# Altium project ESPCM4FPU_V1.PrjPcb
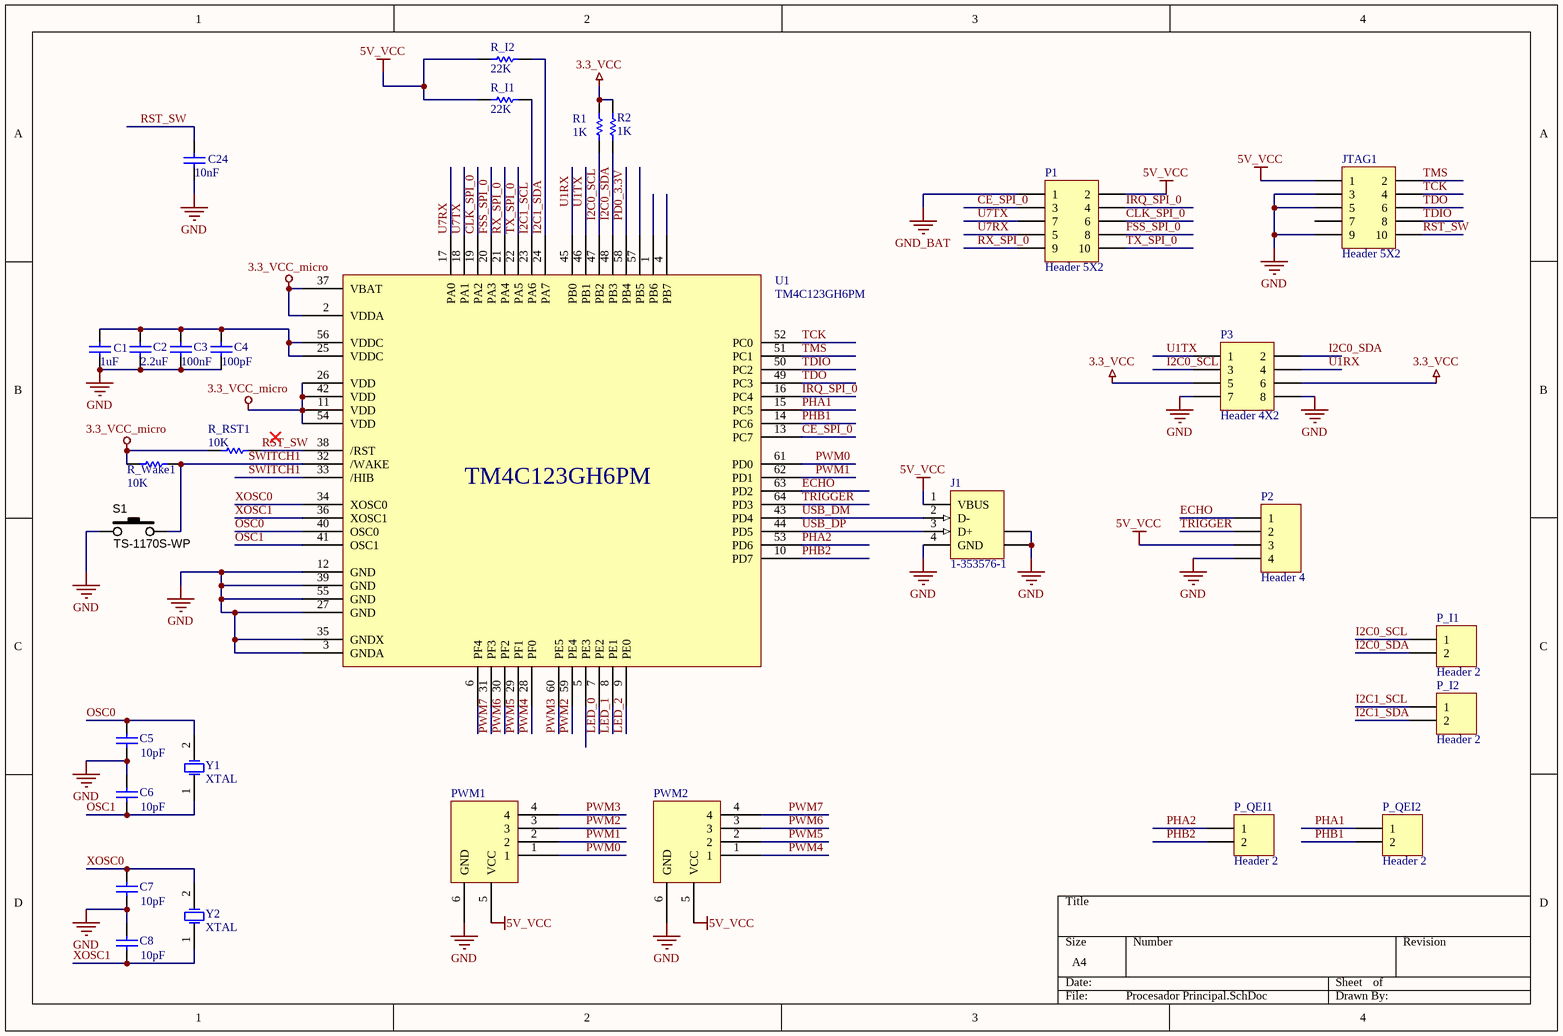
[diagram p0: Procesador Principal.SchDoc]
4 sheets, 76 parts. Net scope: global (net labels, ports and power ports of the same name join across sheets).
Board file: PCB_I.PcbDoc
Sheets:
  Procesador Principal.SchDoc
  Procesador Auxiliar.SchDoc
  Sensores.SchDoc
  Alimentacion.SchDoc

## Sheet Procesador Principal.SchDoc
size A4

### Parts
C1  value 1uF  [6-0805_L]  (hidden comment: Cap)
C2  value 2.2uF  [6-0805_L]  (hidden comment: Cap)
C3  value 100nF  [6-0805_L]  (hidden comment: Cap)
C4  value 100pF  [6-0805_L]  (hidden comment: Cap)
C5  value 10pF  [C0805]  (hidden comment: Cap)
C6  value 10pF  [C0805]  (hidden comment: Cap)
C7  value 10pF  [C0805]  (hidden comment: Cap)
C8  value 10pF  [C0805]  (hidden comment: Cap)
C24  value 10nF  [6-0805_L]  (hidden comment: Cap)
J1  1-353576-1  [Micro USB]
JTAG1  Header 5X2  [HDR2X5]
P1  Header 5X2  [SMD_HEADER 5x2]
P2  Header 4  [HDR1X4]
P3  Header 4X2  [SMD_HEADER 4x2]
P_I1  Header 2  [HDR1X2]
P_I2  Header 2  [HDR1X2]
P_QEI1  Header 2  [HDR1X2]
P_QEI2  Header 2  [HDR1X2]
PWM1  Header 4 x 3  [Header_4x3_mirror]  (value not drawn)
PWM2  Header 4 x 3  [Header_4x3]  (value not drawn)
R1  value 1K  [C0805]  (hidden comment: Res1)
R2  value 1K  [6-0805_L]  (hidden comment: Res1)
R_I1  value 22K  [C1206]  (hidden comment: Res1)
R_I2  value 22K  [C1206]  (hidden comment: Res1)
R_RST1  value 10K  [C1206]  (hidden comment: Res1)
R_Wake1  value 10K  [C0805]  (hidden comment: Res1)
S1  TS-1170S-WP  [TS-1170S]
U1  TM4C123GH6PM  [SQFP50P1200X1200-64L]
Y1  XTAL  [CFPX-5]
Y2  XTAL  [BCY-W2/D2.1]

### Nets
3.3_VCC: P3.5 P3.6 R1.1 R2.2
3.3_VCC_micro: R_RST1.1 R_Wake1.1 U1.2(VDDA) U1.11(VDD) U1.26(VDD) U1.37(VBAT) U1.42(VDD) U1.54(VDD)
5V_VCC: J1.1(VBUS) JTAG1.1 P1.2 P2.3 PWM1.5(VCC) PWM2.5(VCC) R_I1.2 R_I2.2
GND: C1.1 C2.1 C3.1 C4.1 C5.1 C6.2 C7.1 C8.2 C24.1 J1.4(GND) J1.5(SHLD) J1.6(SHLD) JTAG1.3 JTAG1.5 JTAG1.9 P2.4 P3.7 P3.8 PWM1.6(GND) PWM2.6(GND) S1.1 U1.3(GNDA) U1.12(GND) U1.27(GND) U1.35(GNDX) U1.39(GND) U1.55(GND)
GND_BAT: P1.1
CE_SPI_0: P1.3 U1.13(PC7)
CLK_SPI_0: P1.6 U1.19(PA2)
ECHO: P2.1 U1.63(PD2)
FSS_SPI_0: P1.8 U1.20(PA3)
I2C0_SCL: P3.3 P_I1.1 R1.2 U1.47(PB2)
I2C0_SDA: P3.2 P_I1.2 R2.1 U1.48(PB3)
I2C1_SCL: P_I2.1 R_I1.1 U1.23(PA6)
I2C1_SDA: P_I2.2 R_I2.1 U1.24(PA7)
IRQ_SPI_0: P1.4 U1.16(PC4)
LED_0: U1.7(PE2)
LED_1: U1.8(PE1)
LED_2: U1.9(PE0)
OSC0: C5.2 U1.40(OSC0) Y1.2(OSC2)
OSC1: C6.1 U1.41(OSC1) Y1.1(OSC1)
PD0_3.3V: U1.58(PB4)
PHA1: P_QEI2.1 U1.15(PC5)
PHA2: P_QEI1.1 U1.53(PD6)
PHB1: P_QEI2.2 U1.14(PC6)
PHB2: P_QEI1.2 U1.10(PD7)
PWM0: PWM1.1 U1.61(PD0)
PWM1: PWM1.2 U1.62(PD1)
PWM2: PWM1.3 U1.59(PE4)
PWM3: PWM1.4 U1.60(PE5)
PWM4: PWM2.1 U1.28(PF0)
PWM5: PWM2.2 U1.29(PF1)
PWM6: PWM2.3 U1.30(PF2)
PWM7: PWM2.4 U1.31(PF3)
RST_SW: C24.2 JTAG1.10 R_RST1.2 U1.38(/RST)
RX_SPI_0: P1.9 U1.21(PA4)
SWITCH1: R_Wake1.2 S1.2 U1.32(/WAKE) U1.33(/HIB)
TCK: JTAG1.4 U1.52(PC0)
TDIO: JTAG1.8 U1.50(PC2)
TDO: JTAG1.6 U1.49(PC3)
TMS: JTAG1.2 U1.51(PC1)
TRIGGER: P2.2 U1.64(PD3)
TX_SPI_0: P1.10 U1.22(PA5)
U1RX: P3.4 U1.45(PB0)
U1TX: P3.1 U1.46(PB1)
U7RX: P1.5 U1.17(PA0)
U7TX: P1.7 U1.18(PA1)
USB_DM: J1.2(D-) U1.43(PD4)
USB_DP: J1.3(D+) U1.44(PD5)
XOSC0: C7.2 U1.34(XOSC0) Y2.2(OSC2)
XOSC1: C8.1 U1.36(XOSC1) Y2.1(OSC1)
NetC1_2: C1.2 C2.2 C3.2 C4.2 U1.25(VDDC) U1.56(VDDC)

Not connected (* = marked no-connect by the designer): JTAG1 7; U1 1(PB6) 4(PB7) 5(PE3) 6(PF4) 57(PB5)

### Library data of the parts
C1-C8 C24 = Cap: Capacitor; Published: 8-Jun-2000; LatestRevisionDate: 17-Jul-2002; LatestRevisionNote: Re-released for DXP Platform.; PackageReference: RAD-0.3; Publisher: Altium Limited; PackageDescription: Radial Cap, Thru-Hole; 2 Leads; 0.3 in Pin Spacing
J1 = 1-353576-1: USB 1.1, Right Angle, SMT, A Type, Receptacle, 4 Position, White; ContactMaterial: Copper Alloy; ContactPlating: Gold over Palladium Nickel; PCB_Layout: Complies with manufacturer's recommendation.; DrillSize: Corresponds to nominal value.; PanelGround: Without; Published: 15-Jul-2004; DatasheetDocument: 11-Apr-2003; PackageDocument: 11-Apr-2003; PackageReference: 353576; Publisher: Altium Limited; HousingMaterial: Thermoplastic; ComponentLink1Description: Manufacturer Link; ComponentLink1URL: http://www.tycoelectronics.com/; ComponentLink2Description: Packaging Specification; ComponentLink2URL: http://ecommas.tycoelectronics.com/commerce/DocumentDelivery/DDEController?Action=showdoc&DocId=Customer+Drawing%7F353576%7FD%7Ftif%7FJapanese%7FJPN_CD_353576_D.tif
JTAG1 P1 = Header 5X2: Header, 5-Pin, Dual row; LatestRevisionDate: 17-Jul-2002; LatestRevisionNote: Re-released for DXP Platform.; Publisher: Altium Limited
P2 = Header 4: Header, 4-Pin; LatestRevisionDate: 17-Jul-2002; LatestRevisionNote: Re-released for DXP Platform.; Publisher: Altium Limited
P3 = Header 4X2: Header, 4-Pin, Dual row; LatestRevisionDate: 17-Jul-2002; LatestRevisionNote: Re-released for DXP Platform.; Publisher: Altium Limited
P_I1 P_I2 P_QEI1 P_QEI2 = Header 2: Header, 2-Pin; LatestRevisionDate: 17-Jul-2002; LatestRevisionNote: Re-released for DXP Platform.; Publisher: Altium Limited
R1 R2 R_I1 R_I2 R_RST1 R_Wake1 = Res1: Resistor; Published: 8-Jun-2000; LatestRevisionDate: 17-Jul-2002; LatestRevisionNote: Re-released for DXP Platform.; PackageReference: AXIAL-0.3; Publisher: Altium Limited; PackageDescription: Axial Device, Thru-Hole; 2 Leads; 0.3 in Pin Spacing
S1 = SW_SMD_PB_7.0mm: Switch SMD Tact 7.0mm Stem; Manufacturer 1: Bond-Tact; Manufacturer Part Number 1: TS-1170S-WP-200; SCDType: source; Function: On/Off; Package / Case: 6.5x6.5mm; 7.0mm stem; ComponentLink1URL: http://www.bondtact.com.hk/zaspx/productd.aspx?catno=3&subcatid=3&PageNo=2&productno=40; ComponentLink1Description: http://www.bondtact.com.hk/zaspx/productd.aspx?catno=3&subcatid=3&PageNo=2&productno=40
Y1 Y2 = XTAL: Crystal Oscillator; Published: 8-Jun-2000; LatestRevisionDate: 17-Jul-2002; LatestRevisionNote: Re-released for DXP Platform.; PackageReference: R38; Publisher: Altium Limited; PackageDescription: Crystal, Thru-Hole; 2 Leads; Body 3.1 x 8.2 mm (Dia.xH)

## Sheet Procesador Auxiliar.SchDoc
size A4
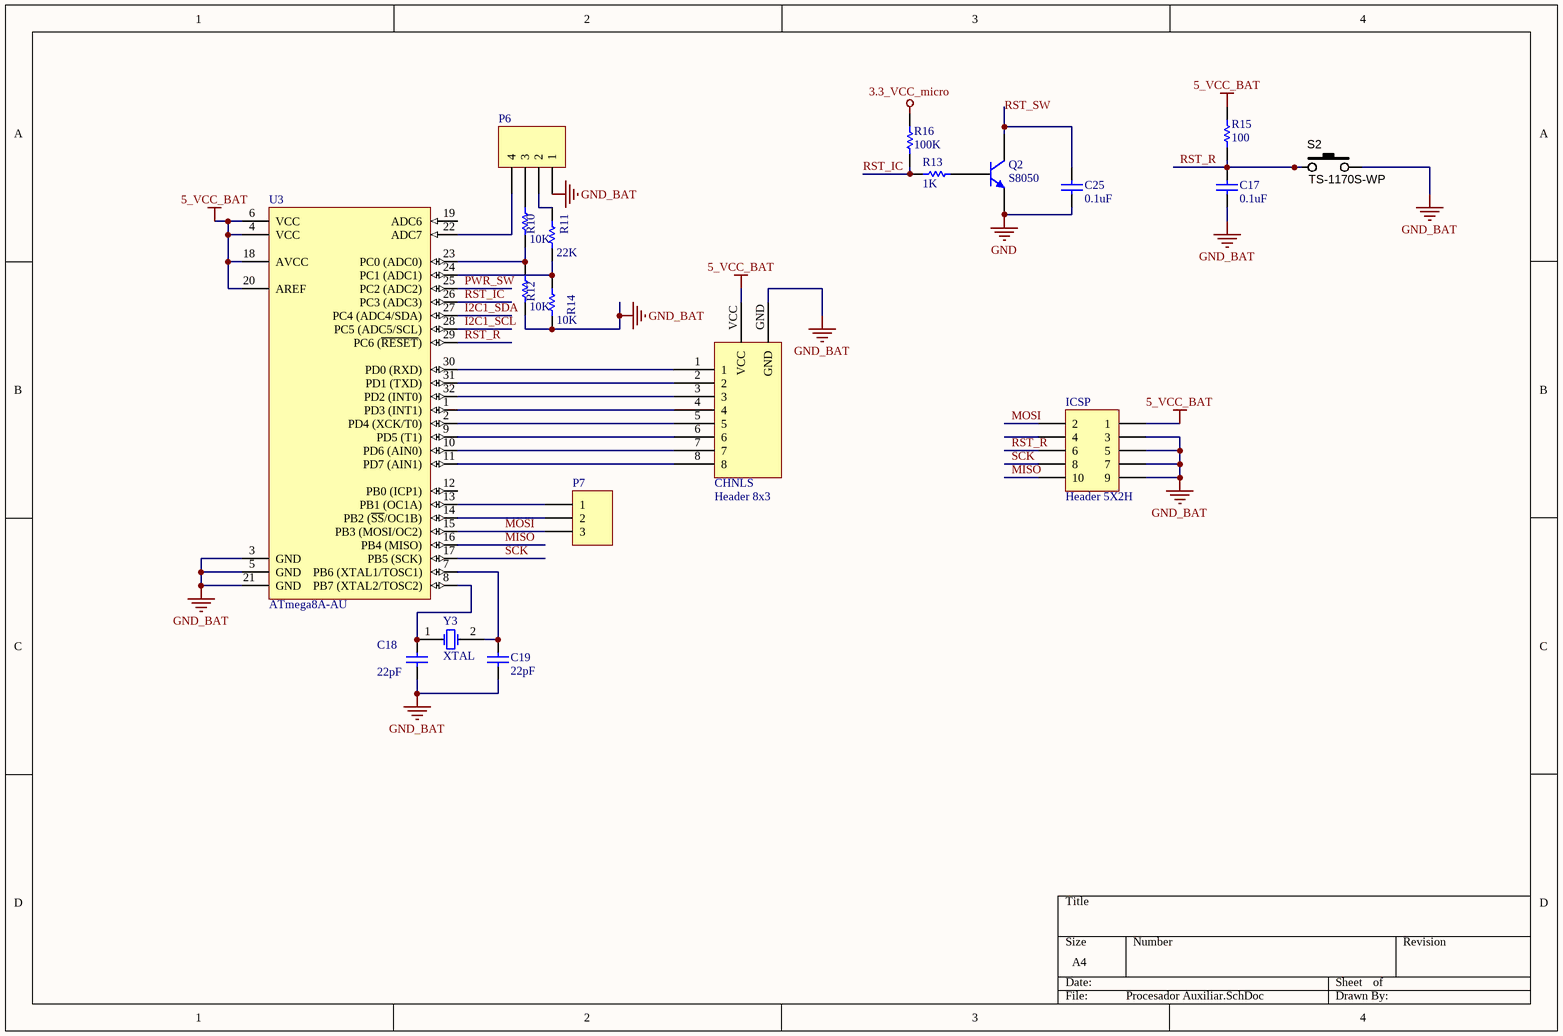
[diagram p1: Procesador Auxiliar.SchDoc]

### Parts
C17  value 0.1uF  [C0805]  (hidden comment: Cap)
C18  value 22pF  [6-0805_L]  (hidden comment: Cap Pol1)
C19  value 22pF  [6-0805_L]  (hidden comment: Cap Pol1)
C25  value 0.1uF  [C0805]  (hidden comment: Cap)
CHNLS  Header 8x3  [Header 8x3_mirror]
ICSP  Header 5X2H  [HDR2X5]
P6  Header 4  [HDR1X4]  (value not drawn)
P7  Header 3  [HDR1X3]  (value not drawn)
Q2  S8050  [SOT23-3]
R10  value 10K  [C0805]  (hidden comment: Res1)
R11  value 22K  [C0805]  (hidden comment: Res1)
R12  value 10K  [C1206]  (hidden comment: Res1)
R13  value 1K  [C0805]  (hidden comment: Res1)
R14  value 10K  [C0805]  (hidden comment: Res1)
R15  value 100  [C0805]  (hidden comment: Res1)
R16  value 100K  [C0805]  (hidden comment: Res1)
S2  TS-1170S-WP  [TS-1170S]
U3  ATmega8A-AU  [32A_N]
Y3  XTAL  [4SMX]

### Nets
3.3_VCC_micro: R16.1
5_VCC_BAT: CHNLS.VCC ICSP.1 R15.1 U3.4(VCC) U3.6(VCC) U3.18(AVCC) U3.20(AREF)
GND: C25.1 Q2.2(E)
GND_BAT: C17.1 C18.1 C19.1 CHNLS.GND ICSP.3 ICSP.5 ICSP.7 ICSP.9 P6.1 R12.1 R14.1 S2.2 U3.3(GND) U3.5(GND) U3.21(GND)
I2C1_SCL: U3.28(PC5_(ADC5/SCL))
I2C1_SDA: U3.27(PC4_(ADC4/SDA))
MISO: ICSP.10 U3.16(PB4_(MISO))
MOSI: ICSP.2 P7.3 U3.15(PB3_(MOSI/OC2))
PWR_SW: U3.25(PC2_(ADC2))
RST_IC: R13.2 R16.2 U3.26(PC3_(ADC3))
RST_R: C17.2 ICSP.6 R15.2 S2.1 U3.29(PC6_(~{RESET}))
RST_SW: C25.2 Q2.3(C)
SCK: ICSP.8 U3.17(PB5_(SCK))
NetC18_2: C18.2 U3.8(PB7_(XTAL2/TOSC2)) Y3.1(OSC1)
NetC19_2: C19.2 U3.7(PB6_(XTAL1/TOSC1)) Y3.2(OSC2)
NetCHNLS_1: CHNLS.1 U3.30(PD0_(RXD))
NetCHNLS_2: CHNLS.2 U3.31(PD1_(TXD))
NetCHNLS_3: CHNLS.3 U3.32(PD2_(INT0))
NetCHNLS_4: CHNLS.4 U3.1(PD3_(INT1))
NetCHNLS_5: CHNLS.5 U3.2(PD4_(XCK/T0))
NetCHNLS_6: CHNLS.6 U3.9(PD5_(T1))
NetCHNLS_7: CHNLS.7 U3.10(PD6_(AIN0))
NetCHNLS_8: CHNLS.8 U3.11(PD7_(AIN1))
NetP6_2: P6.2 R11.2
NetP6_3: P6.3 R10.2
NetP6_4: P6.4 U3.22(ADC7)
NetP7_1: P7.1 U3.13(PB1_(OC1A))
NetP7_2: P7.2 U3.14(PB2_(~{SS}/OC1B))
NetQ2_1: Q2.1(B) R13.1
NetR10_1: R10.1 R12.2 U3.23(PC0_(ADC0))
NetR11_1: R11.1 R14.2 U3.24(PC1_(ADC1))

Not connected (* = marked no-connect by the designer): ICSP 4; U3 12(PB0_(ICP1)) 19(ADC6)

### Library data of the parts
C17-C19 C25 = Cap: Capacitor; Published: 8-Jun-2000; LatestRevisionDate: 17-Jul-2002; LatestRevisionNote: Re-released for DXP Platform.; PackageReference: RAD-0.3; Publisher: Altium Limited; PackageDescription: Radial Cap, Thru-Hole; 2 Leads; 0.3 in Pin Spacing
ICSP = Header 5X2H: Header, 5-Pin, Dual row, Right Angle; LatestRevisionDate: 17-Jul-2002; LatestRevisionNote: Re-released for DXP Platform.; Publisher: Altium Limited
P6 = Header 4: Header, 4-Pin; LatestRevisionDate: 17-Jul-2002; LatestRevisionNote: Re-released for DXP Platform.; Publisher: Altium Limited
P7 = Header 3: Header, 3-Pin; LatestRevisionDate: 17-Jul-2002; LatestRevisionNote: Re-released for DXP Platform.; Publisher: Altium Limited
Q2 = S8050: NPN SMD General Purpose Amplifier; Published: 8-Jun-2000; LatestRevisionDate: 15-Jan-2003; LatestRevisionNote: PCB Footprint 'BCY-W3/D4.7' replaced; DatasheetVersion: 1997; PackageVersion: Sep-1998; PackageReference: TO-92A; Publisher: Altium Limited; PackageDescription: TO, Flat Index; 3 In-Line, Axial Leads; Body Dia. 4.5mm; Leads 0.51 x 0.48 mm (max); ComponentLink1Description: Manufacturer Link; ComponentLink1URL: http://www.fairchildsemi.com/; ComponentLink2Description: Datasheet; ComponentLink2URL: http://www.fairchildsemi.com/ds/2N%2F2N3904.pdf
R10-R16 = Res1: Resistor; Published: 8-Jun-2000; LatestRevisionDate: 17-Jul-2002; LatestRevisionNote: Re-released for DXP Platform.; PackageReference: AXIAL-0.3; Publisher: Altium Limited; PackageDescription: Axial Device, Thru-Hole; 2 Leads; 0.3 in Pin Spacing
S2 = SW_SMD_PB_7.0mm: as S1 on sheet Procesador Principal; Package / Case: 6.5x6.5mm; 7.0mm stem; ComponentLink1URL: http://www.bondtact.com.hk/zaspx/productd.aspx?catno=3&subcatid=3&PageNo=2&productno=40; ComponentLink1Description: http://www.bondtact.com.hk/zaspx/productd.aspx?catno=3&subcatid=3&PageNo=2&productno=40
U3 = ATmega8A-AU: 8-bit AVR Microcontroller, 8KB Flash, 512 Bytes EEPROM, 1KB SRAM, 32-pin TQFP, Industrial Grade (-40°C to 85°C); Published: 1-Apr-2010; DatasheetVersion: revC, Jul-2009; PackageVersion: revB, Oct-2001; PackageReference: 32A; Publisher: Altium Limited; PackageDescription: 32-Lead, 7x7x1.0 mm Body, 0.8mm Lead Pitch, Thin Profile Plastic Quad Flat Package (TQFP); Supplier 1: Digi-Key; Supplier Part Number 1: ATMEGA8A-AU-ND; Supplier 2: Farnell; Supplier Part Number 2: 1748532; Supplier 3: Mouser; Supplier Part Number 3: 556-ATMEGA8A-AU; Code_JEDEC: MS-026-ABA; ComponentLink1Description: Manufacturer Link; ComponentLink1URL: http://www.atmel.com/products/avr/default.asp?; ComponentLink2Description: ATmega8A Datasheet; ComponentLink2URL: http://www.atmel.com/dyn/resources/prod_documents/doc8159.pdf; ComponentLink3Description: ATmega8A Summary; ComponentLink3URL: http://www.atmel.com/dyn/resources/prod_documents/8159S.pdf; ComponentLink4Description: Atmel.com Home; ComponentLink4URL: http://www.atmel.com
Y3 = XTAL: Crystal Oscillator; Published: 8-Jun-2000; LatestRevisionDate: 17-Jul-2002; LatestRevisionNote: Re-released for DXP Platform.; PackageReference: R38; Publisher: Altium Limited; PackageDescription: Crystal, Thru-Hole; 2 Leads; Body 3.1 x 8.2 mm (Dia.xH)

## Sheet Sensores.SchDoc
size A4
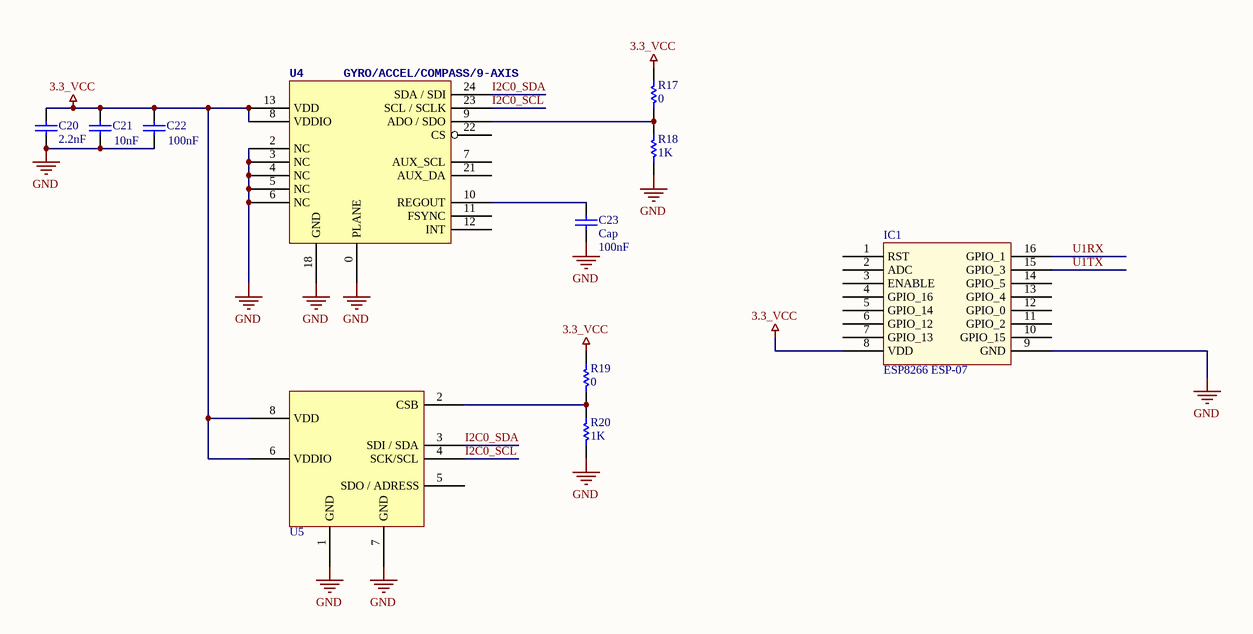
[diagram p2: Sensores.SchDoc]

### Parts
C20  value 2.2nF  [6-0805_L]  (hidden comment: Cap)
C21  value 10nF  [6-0805_L]  (hidden comment: Cap)
C22  value 100nF  [6-0805_L]  (hidden comment: Cap)
C23  Cap  value 100nF  [6-0805_L]
IC1  ESP8266 ESP-07  [ESP8266 ESP-ANTENNA]
R17  value 0  [C0805]  (hidden comment: Res1)
R18  value 1K  [C0805]  (hidden comment: Res1)
R19  value 0  [C0805]  (hidden comment: Res1)
R20  value 1K  [6-0805_L]  (hidden comment: Res1)
U4  GYRO/ACCEL/COMPASS/9-AXIS  [QFN-24/3MM]
U5  BMP280  [LGA-8_BMP280(Primary)]  (value not drawn)

### Nets
3.3_VCC: C20.1 C21.2 C22.2 IC1.8(VDD) R17.2 R19.2 U4.8(VDDIO) U4.13(VDD) U5.6(VDDIO) U5.8(VDD)
GND: C20.2 C21.1 C22.1 C23.1 IC1.9(GND) R18.2 R20.2 U4.0(PLANE) U4.2(NC) U4.3(NC) U4.4(NC) U4.5(NC) U4.6(NC) U4.18(GND) U5.1(GND) U5.7(GND)
I2C0_SCL: U4.23(SCL_/_SCLK) U5.4(SCK/SCL)
I2C0_SDA: U4.24(SDA_/_SDI) U5.3(SDI_/_SDA)
U1RX: IC1.16(GPIO_1)
U1TX: IC1.15(GPIO_3)
NetC23_2: C23.2 U4.10(REGOUT)
NetR17_1: R17.1 R18.1 U4.9(ADO_/_SDO)
NetR19_1: R19.1 R20.1 U5.2(CSB)

Not connected (* = marked no-connect by the designer): IC1 1(RST) 2(ADC) 3(ENABLE) 4(GPIO_16) 5(GPIO_14) 6(GPIO_12) 7(GPIO_13) 10(GPIO_15) 11(GPIO_2) 12(GPIO_0) 13(GPIO_4) 14(GPIO_5); U4 7(AUX_SCL) 11(FSYNC) 12(INT) 21(AUX_DA) 22(CS); U5 5(SDO_/_ADRESS)

### Library data of the parts
C20-C23 = Cap: Capacitor; Published: 8-Jun-2000; LatestRevisionDate: 17-Jul-2002; LatestRevisionNote: Re-released for DXP Platform.; PackageReference: RAD-0.3; Publisher: Altium Limited; PackageDescription: Radial Cap, Thru-Hole; 2 Leads; 0.3 in Pin Spacing
R17-R20 = Res1: Resistor; Published: 8-Jun-2000; LatestRevisionDate: 17-Jul-2002; LatestRevisionNote: Re-released for DXP Platform.; PackageReference: AXIAL-0.3; Publisher: Altium Limited; PackageDescription: Axial Device, Thru-Hole; 2 Leads; 0.3 in Pin Spacing
U4 = MPU-9250
U5 = BMP280: Barometro; Value: *

## Sheet Alimentacion.SchDoc
size A4
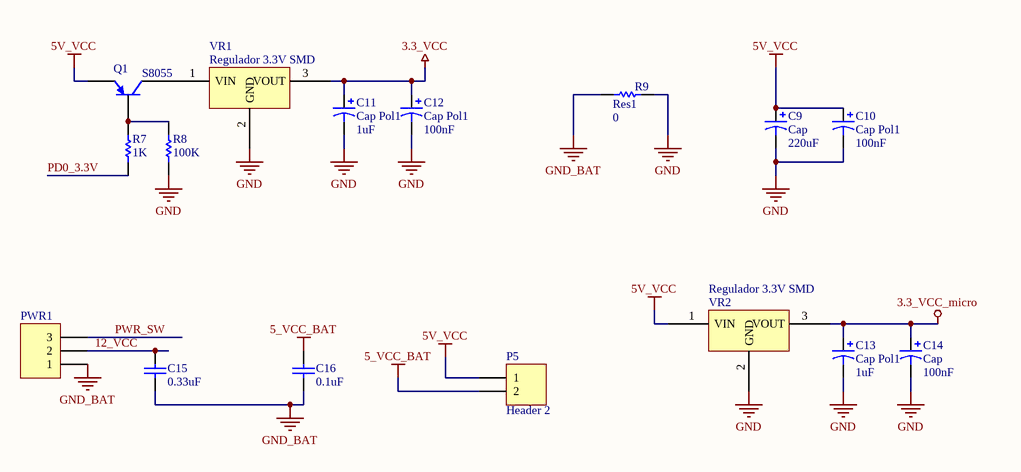
[diagram p3: Alimentacion.SchDoc]

### Parts
C9  Cap  value 220uF  [C0805]
C10  Cap Pol1  value 100nF  [6-0805_L]
C11  Cap Pol1  value 1uF  [C0805]
C12  Cap Pol1  value 100nF  [C0805]
C13  Cap Pol1  value 1uF  [C0805]
C14  Cap  value 100nF  [6-0805_L]
C15  value 0.33uF  [6-0805_L]  (hidden comment: Cap)
C16  value 0.1uF  [C0805]  (hidden comment: Cap)
P5  Header 2  [HDR1X2]
PWR1  Header 3  [HDR1X3]  (value not drawn)
Q1  S8055  [SOT23-3]
R7  value 1K  [C0805]  (hidden comment: Res1)
R8  value 100K  [C0805]  (hidden comment: Res1)
R9  Res1  value 0  [C0805]
VR1  Regulador 3.3V SMD  [SOT223]
VR2  Regulador 3.3V SMD  [SOT223]

### Nets
3.3_VCC: C11.1 C12.1 VR1.3(VOUT)
3.3_VCC_micro: C13.1 C14.1 VR2.3(VOUT)
5_VCC_BAT: C16.2 P5.2
5V_VCC: C9.1 C10.1 P5.1 Q1.2(E) VR2.1(VIN)
GND: C9.2 C10.2 C11.2 C12.2 C13.2 C14.2 R8.1 R9.2 VR1.2(GND) VR2.2(GND)
GND_BAT: C15.1 C16.1 PWR1.1 R9.1
12_VCC: C15.2 PWR1.2
PD0_3.3V: R7.1
PWR_SW: PWR1.3
NetQ1_1: Q1.1(B) R7.2 R8.2
NetQ1_3: Q1.3(C) VR1.1(VIN)

### Library data of the parts
C9-C14 = Cap Pol1: Polarized Capacitor (Radial); Published: 8-Jun-2000; LatestRevisionDate: 17-Jul-2002; LatestRevisionNote: Re-released for DXP Platform.; PackageReference: RB7.6-15; Publisher: Altium Limited; PackageDescription: Polarized Capacitor (Radial); 2 Leads
C15 C16 = Cap: Capacitor; Published: 8-Jun-2000; LatestRevisionDate: 17-Jul-2002; LatestRevisionNote: Re-released for DXP Platform.; PackageReference: RAD-0.3; Publisher: Altium Limited; PackageDescription: Radial Cap, Thru-Hole; 2 Leads; 0.3 in Pin Spacing
P5 = Header 2: Header, 2-Pin; LatestRevisionDate: 17-Jul-2002; LatestRevisionNote: Re-released for DXP Platform.; Publisher: Altium Limited
PWR1 = Header 3: Header, 3-Pin; LatestRevisionDate: 17-Jul-2002; LatestRevisionNote: Re-released for DXP Platform.; Publisher: Altium Limited
Q1 = S8055: PNP SMD General Purpose Amplifier; Published: 8-Jun-2000; LatestRevisionDate: 15-Jan-2003; LatestRevisionNote: PCB Footprint 'BCY-W3/D4.7' replaced; DatasheetVersion: 1997; PackageVersion: Sep-1998; PackageReference: TO-92A; Publisher: Altium Limited; PackageDescription: TO, Flat Index; 3 In-Line, Axial Leads; Body Dia. 4.5mm; Leads 0.51 x 0.48 mm (max); ComponentLink1Description: Manufacturer Link; ComponentLink1URL: http://www.fairchildsemi.com/; ComponentLink2Description: Datasheet; ComponentLink2URL: http://www.fairchildsemi.com/ds/2N%2F2N3906.pdf
R7-R9 = Res1: Resistor; Published: 8-Jun-2000; LatestRevisionDate: 17-Jul-2002; LatestRevisionNote: Re-released for DXP Platform.; PackageReference: AXIAL-0.3; Publisher: Altium Limited; PackageDescription: Axial Device, Thru-Hole; 2 Leads; 0.3 in Pin Spacing
VR1 VR2 = Regulador 3.3V SMD: AMS1117; pin to pad: 1>3 2>1 3>2

## Nets that join several sheets
3.3_VCC: Procesador Principal (P3.5 P3.6 R1.1 R2.2), Sensores (10 pins), Alimentacion (C11.1 C12.1 VR1.3)
3.3_VCC_micro: Procesador Principal (8 pins), Procesador Auxiliar (R16.1), Alimentacion (C13.1 C14.1 VR2.3)
5_VCC_BAT: Procesador Auxiliar (7 pins), Alimentacion (C16.2 P5.2)
5V_VCC: Procesador Principal (8 pins), Alimentacion (5 pins)
GND: Procesador Principal (27 pins), Procesador Auxiliar (C25.1 Q2.2), Sensores (16 pins), Alimentacion (10 pins)
GND_BAT: Procesador Principal (P1.1), Procesador Auxiliar (15 pins), Alimentacion (C15.1 C16.1 PWR1.1 R9.1)
I2C0_SCL: Procesador Principal (P3.3 P_I1.1 R1.2 U1.47), Sensores (U4.23 U5.4)
I2C0_SDA: Procesador Principal (P3.2 P_I1.2 R2.1 U1.48), Sensores (U4.24 U5.3)
I2C1_SCL: Procesador Principal (P_I2.1 R_I1.1 U1.23), Procesador Auxiliar (U3.28)
I2C1_SDA: Procesador Principal (P_I2.2 R_I2.1 U1.24), Procesador Auxiliar (U3.27)
PD0_3.3V: Procesador Principal (U1.58), Alimentacion (R7.1)
PWR_SW: Procesador Auxiliar (U3.25), Alimentacion (PWR1.3)
RST_SW: Procesador Principal (C24.2 JTAG1.10 R_RST1.2 U1.38), Procesador Auxiliar (C25.2 Q2.3)
U1RX: Procesador Principal (P3.4 U1.45), Sensores (IC1.16)
U1TX: Procesador Principal (P3.1 U1.46), Sensores (IC1.15)